# Altium schematic sheet SubBus3.SchDoc
size A
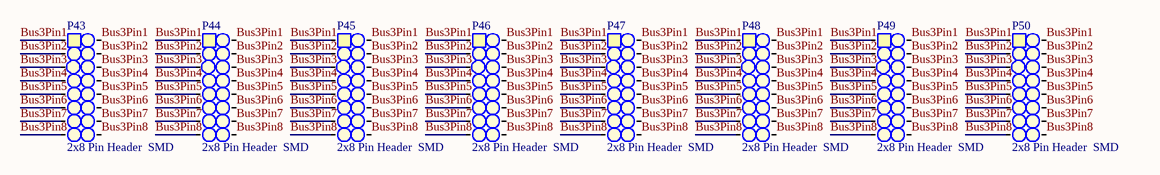
[diagram p0: SubBus3.SchDoc]

## Parts
P43  2x8 Pin Header  SMD  [2X8_SMD_PH_2.54]
P44  2x8 Pin Header  SMD  [2X8_SMD_PH_2.54]
P45  2x8 Pin Header  SMD  [2X8_SMD_PH_2.54]
P46  2x8 Pin Header  SMD  [2X8_SMD_PH_2.54]
P47  2x8 Pin Header  SMD  [2X8_SMD_PH_2.54]
P48  2x8 Pin Header  SMD  [2X8_SMD_PH_2.54]
P49  2x8 Pin Header  SMD  [2X8_SMD_PH_2.54]
P50  2x8 Pin Header  SMD  [2X8_SMD_PH_2.54]

## Nets
Bus3Pin1: P43.1 P43.16 P44.1 P44.16 P45.1 P45.16 P46.1 P46.16 P47.1 P47.16 P48.1 P48.16 P49.1 P49.16 P50.1 P50.16
Bus3Pin2: P43.2 P43.15 P44.2 P44.15 P45.2 P45.15 P46.2 P46.15 P47.2 P47.15 P48.2 P48.15 P49.2 P49.15 P50.2 P50.15
Bus3Pin3: P43.3 P43.14 P44.3 P44.14 P45.3 P45.14 P46.3 P46.14 P47.3 P47.14 P48.3 P48.14 P49.3 P49.14 P50.3 P50.14
Bus3Pin4: P43.4 P43.13 P44.4 P44.13 P45.4 P45.13 P46.4 P46.13 P47.4 P47.13 P48.4 P48.13 P49.4 P49.13 P50.4 P50.13
Bus3Pin5: P43.5 P43.12 P44.5 P44.12 P45.5 P45.12 P46.5 P46.12 P47.5 P47.12 P48.5 P48.12 P49.5 P49.12 P50.5 P50.12
Bus3Pin6: P43.6 P43.11 P44.6 P44.11 P45.6 P45.11 P46.6 P46.11 P47.6 P47.11 P48.6 P48.11 P49.6 P49.11 P50.6 P50.11
Bus3Pin7: P43.7 P43.10 P44.7 P44.10 P45.7 P45.10 P46.7 P46.10 P47.7 P47.10 P48.7 P48.10 P49.7 P49.10 P50.7 P50.10
Bus3Pin8: P43.8 P43.9 P44.8 P44.9 P45.8 P45.9 P46.8 P46.9 P47.8 P47.9 P48.8 P48.9 P49.8 P49.9 P50.8 P50.9

## Library data of the parts
P43-P50 = 2x8 Pin Header  SMD: 2.54mm, SMD; Value: 2x8 Pin Header, 2.54mm, SMD; Farnell: 2356242